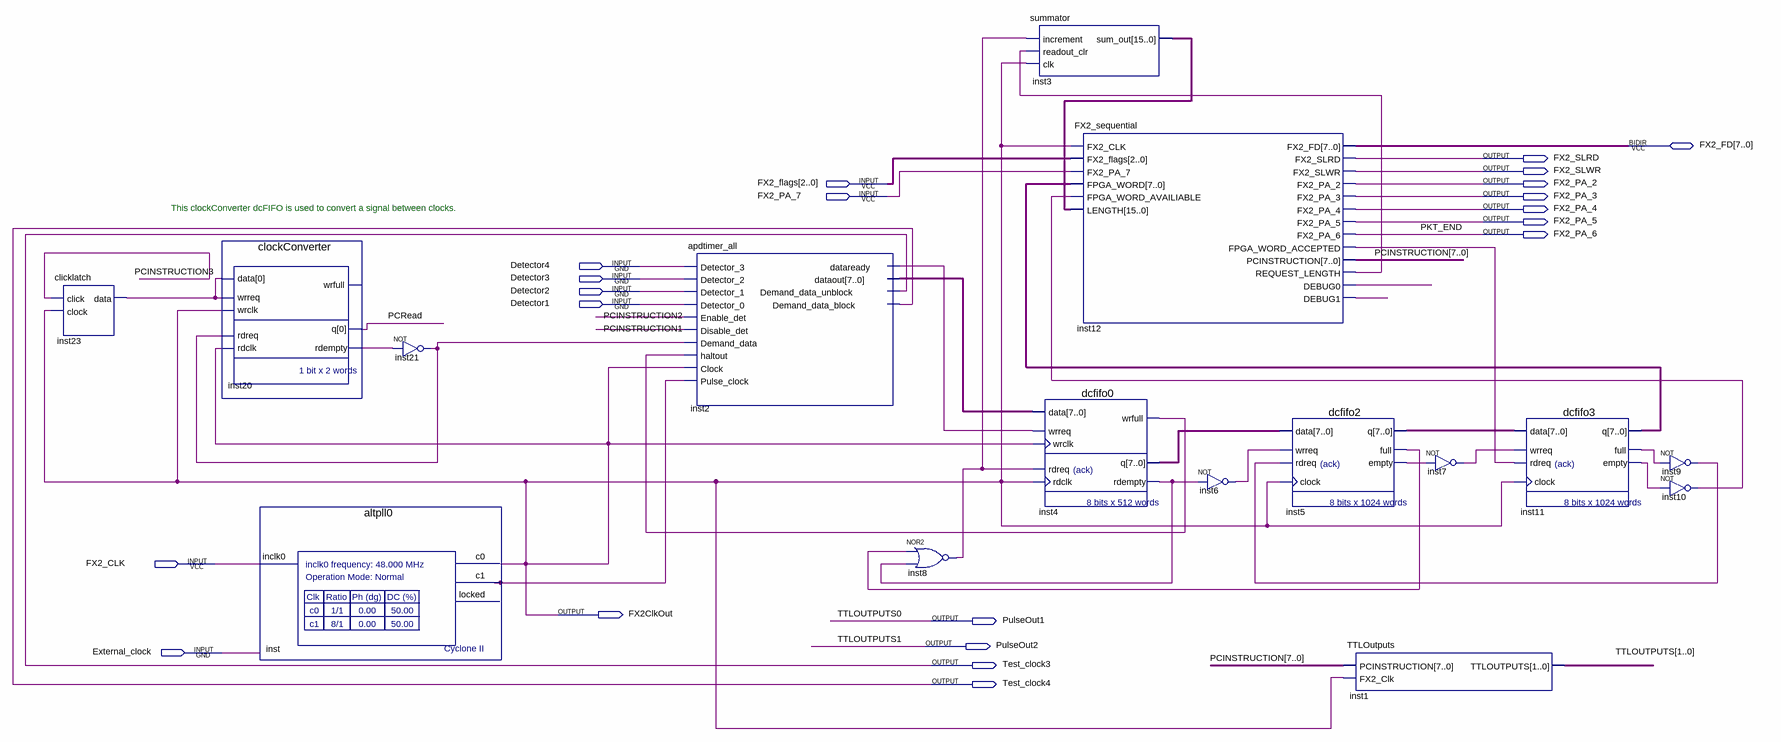
[diagram p0: schematic sheet]
// Quartus schematic testingigo_all.bdf as structural Verilog: 16 symbols, 21 pins
module testingigo_all (
  input  [2:0] FX2_flags,
  input  FX2_PA_7,
  input  Detector4,
  input  Detector3,
  input  Detector2,
  input  Detector1,
  input  FX2_CLK,
  input  External_clock,
  inout  [7:0] FX2_FD,
  output FX2_SLRD,
  output FX2_SLWR,
  output FX2_PA_2,
  output FX2_PA_3,
  output FX2_PA_4,
  output FX2_PA_5,
  output FX2_PA_6,
  output FX2ClkOut,
  output PulseOut1,
  output PulseOut2,
  output Test_clock3,
  output Test_clock4
);

  wire inst2_dataready, inst4_rdempty, inst4_wrfull, inst5_empty, inst5_full, inst6_out, inst7_out,
       inst8_out, inst9_out, inst10_out, inst11_empty, inst11_full, inst12_debug0, inst12_debug1,
       inst12_fpga_word_accepted, inst12_request_length, inst20_rdempty, inst21_out, inst23_data, inst_c1,
       PCRead;
  wire [7:0] inst2_dataout, inst4_q, inst5_q, inst11_q, PCINSTRUCTION;
  wire [15:0] inst3_sum_out;

  clicklatch inst23 (.click(PCINSTRUCTION[3]), .clock(FX2ClkOut), .data(inst23_data));
  clockConverter inst20 (
    .data(inst23_data), .wrreq(inst23_data), .wrclk(FX2ClkOut), .rdreq(inst21_out), .rdclk(FX2ClkOut),
    .q(PCRead), .rdempty(inst20_rdempty));  // open: wrfull
  altpll0 inst (.inclk0(FX2_CLK), .c0(FX2ClkOut), .c1(inst_c1));  // open: locked
  not inst21 (inst21_out, inst20_rdempty);
  apdtimer_all inst2 (
    .Detector_3(Detector4), .Detector_2(Detector3), .Detector_1(Detector2), .Detector_0(Detector1),
    .Enable_det(PCINSTRUCTION[2]), .Disable_det(PCINSTRUCTION[1]), .Demand_data(inst21_out),
    .haltout(inst4_wrfull), .Clock(FX2ClkOut), .Pulse_clock(inst_c1), .dataready(inst2_dataready),
    .dataout(inst2_dataout), .Demand_data_unblock(Test_clock3), .Demand_data_block(Test_clock4));
  nor inst8 (inst8_out, inst5_full, inst4_rdempty);
  summator inst3 (.increment(inst8_out), .readout_clr(inst12_request_length), .clk(FX2ClkOut), .sum_out(inst3_sum_out));
  FX2_sequential inst12 (
    .FX2_CLK(FX2ClkOut), .FX2_flags(FX2_flags), .FX2_PA_7(FX2_PA_7), .FPGA_WORD(inst11_q),
    .FPGA_WORD_AVAILIABLE(inst10_out), .LENGTH(inst3_sum_out), .FX2_SLRD(FX2_SLRD), .FX2_SLWR(FX2_SLWR),
    .FX2_PA_2(FX2_PA_2), .FX2_PA_3(FX2_PA_3), .FX2_PA_4(FX2_PA_4), .FX2_PA_5(FX2_PA_5), .FX2_PA_6(FX2_PA_6),
    .FPGA_WORD_ACCEPTED(inst12_fpga_word_accepted), .PCINSTRUCTION(PCINSTRUCTION),
    .REQUEST_LENGTH(inst12_request_length), .DEBUG0(inst12_debug0), .DEBUG1(inst12_debug1), .FX2_FD(FX2_FD));
  dcfifo0 inst4 (
    .data(inst2_dataout), .wrreq(inst2_dataready), .wrclk(FX2ClkOut), .rdreq(inst8_out), .rdclk(FX2ClkOut),
    .wrfull(inst4_wrfull), .q(inst4_q), .rdempty(inst4_rdempty));
  not inst6 (inst6_out, inst4_rdempty);
  dcfifo2 inst5 (
    .data(inst4_q), .wrreq(inst6_out), .rdreq(inst9_out), .clock(FX2ClkOut), .q(inst5_q), .full(inst5_full),
    .empty(inst5_empty));
  TTLOutputs inst1 (.PCINSTRUCTION(PCINSTRUCTION), .FX2_Clk(FX2ClkOut), .TTLOUTPUTS({PulseOut2, PulseOut1}));
  not inst7 (inst7_out, inst5_empty);
  dcfifo3 inst11 (
    .data(inst5_q), .wrreq(inst7_out), .rdreq(inst12_fpga_word_accepted), .clock(FX2ClkOut), .q(inst11_q),
    .full(inst11_full), .empty(inst11_empty));
  not inst9 (inst9_out, inst11_full);
  not inst10 (inst10_out, inst11_empty);

  // Other names for the same wires on the sheet: PKT_END = FX2_PA_6; TTLOUTPUTS[1:0] = {PulseOut2, PulseOut1};
  //   TTLOUTPUTS0 = PulseOut1; TTLOUTPUTS1 = PulseOut2

  // Notes on the sheet:
  //   This clockConverter dcFIFO is used to convert a signal between clocks.
endmodule
